# EAGLE schematic battery_buzzer (EAGLE 6.6.0)
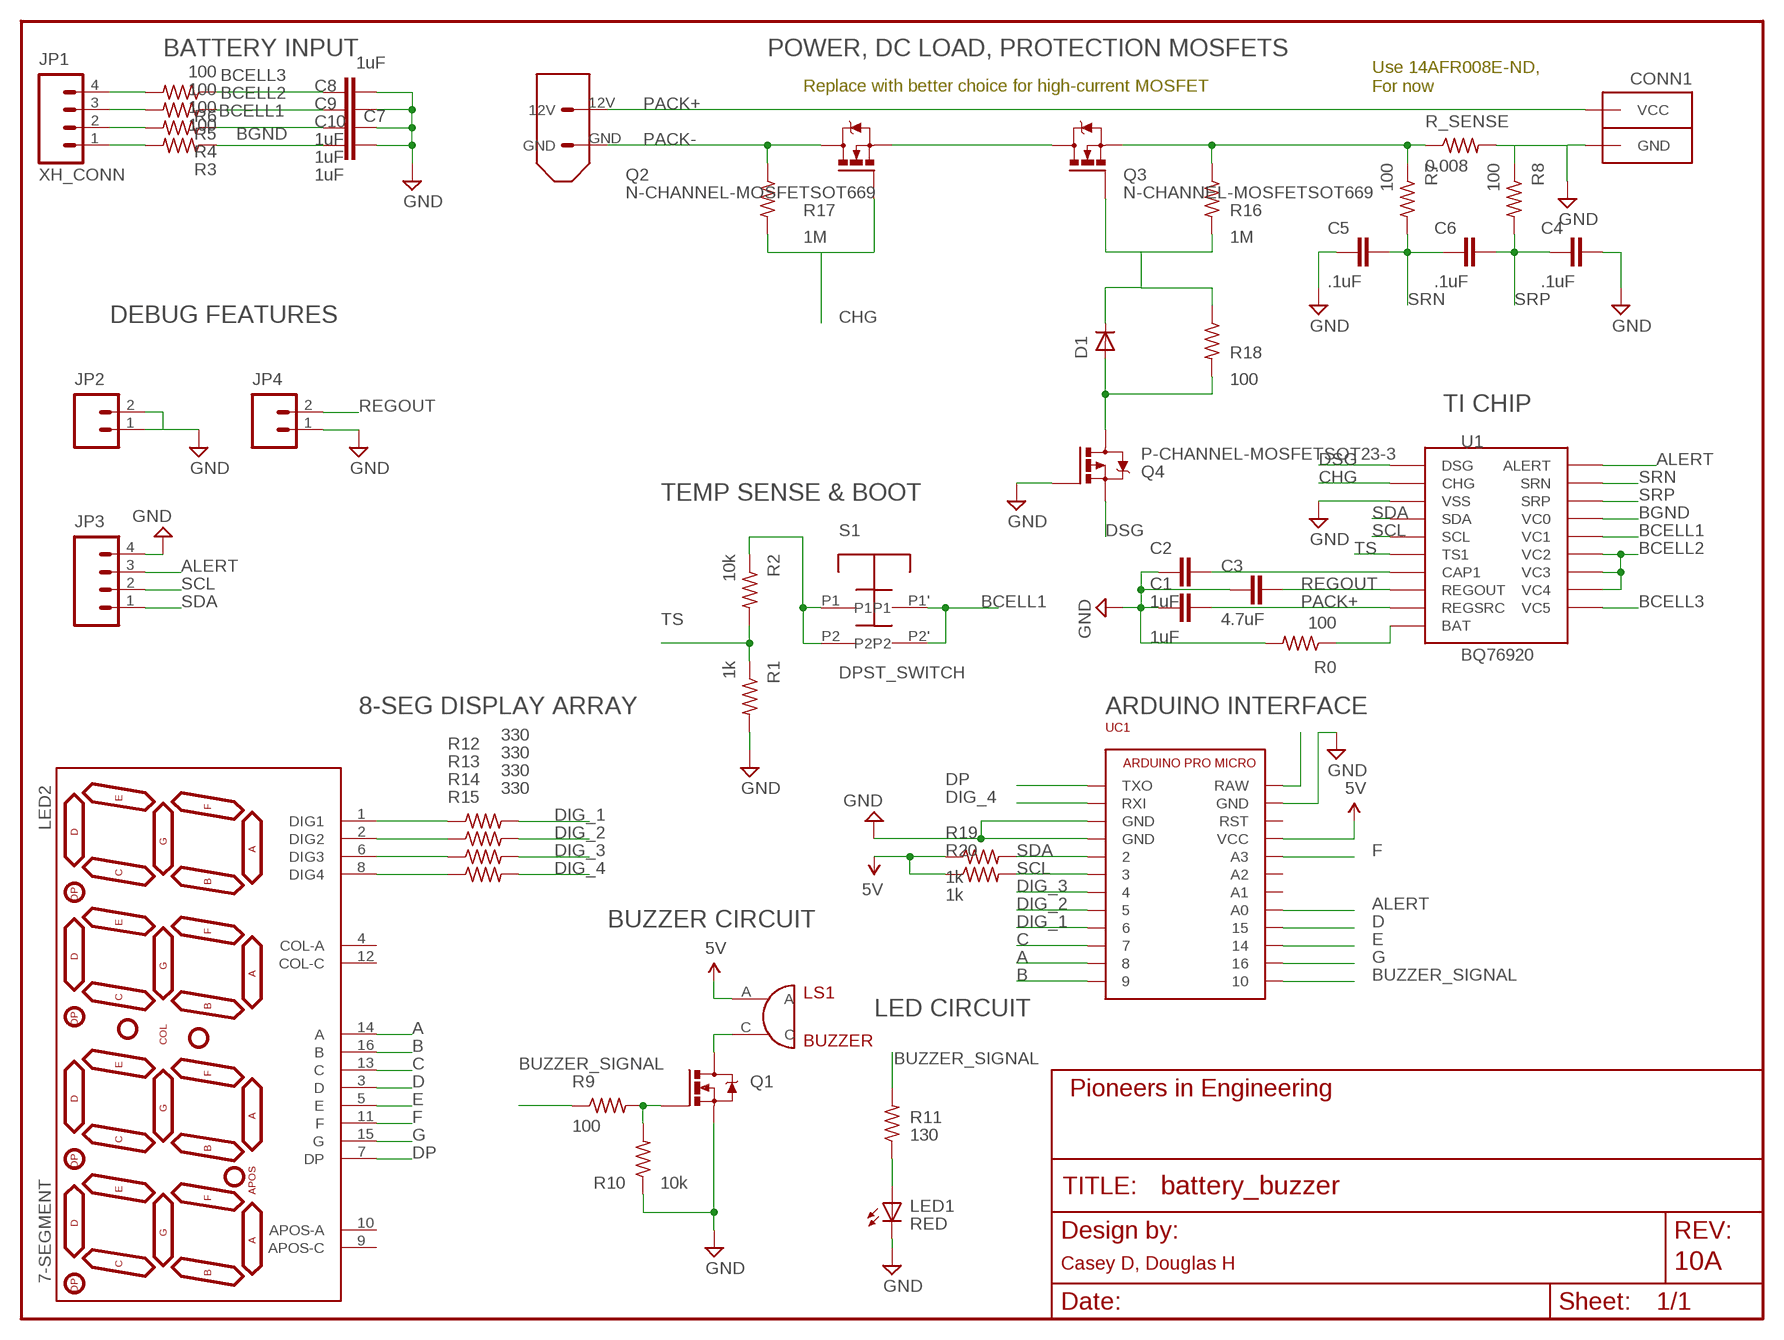
[diagram p0: schematic, sheet 1]
FRAME1 (FRAME-LETTER): AUTHOR: Casey D, Douglas H; REVISION: 10A

## Parts
C1  1uF  CAP0603-CAP  [0603-CAP]
C2  1uF  CAP0603-CAP  [0603-CAP]
C3  4.7uF  CAP0603-CAP  [0603-CAP]
C4  .1uF  CAP0603-CAP  [0603-CAP]
C5  .1uF  CAP0603-CAP  [0603-CAP]
C6  .1uF  CAP0603-CAP  [0603-CAP]
C7  1uF  CAP0603-CAP  [0603-CAP]
C8  1uF  CAP0603-CAP  [0603-CAP]
C9  1uF  CAP0603-CAP  [0603-CAP]
C10  1uF  CAP0603-CAP  [0603-CAP]
CONN1  ANDERSONVERTICAL  [ANDERSON_VERTICAL]
D1  DIODESOD-323  [SOD-323]
JP1  XH_CONN  XH_CONNECTOR_4POS  [XH_CONNECTOR_4POS_2.5MM]
JP2  M02PTH  [1X02]
JP3  M04PTH  [1X04]
JP4  M02PTH  [1X02]
LED1  RED  LED0805  [LED-0805]
LED2  7-SEGMENT  7-SEGMENT-4DIGIT-YOUNGSUN  [7-SEGMENT-4DIGIT-YOUNGSUN]
LS1  BUZZER  [BUZZER_MAGNETIC_5V_12MM_RADIAL]
Q1  IRFML8244  N-CHANNEL-MOSFETSOT23-3  [SOT23-3]
Q2  N-CHANNEL-MOSFETSOT669  [SOT669]
Q3  N-CHANNEL-MOSFETSOT669  [SOT669]
Q4  P-CHANNEL-MOSFETSOT23-3  [SOT23-3]
R0  100  R-US_R0603  [R0603]
R1  1k  R-US_R0603  [R0603]
R2  10k  R-US_R0603  [R0603]
R3  100  R-US_R0603  [R0603]
R4  100  R-US_R0603  [R0603]
R5  100  R-US_R0603  [R0603]
R6  100  R-US_R0603  [R0603]
R7  100  R-US_R0603  [R0603]
R8  100  R-US_R0603  [R0603]
R9  100  R-US_R0603  [R0603]
R10  10k  R-US_R0603  [R0603]
R11  130  R-US_R0603  [R0603]
R12  330  R-US_R0603  [R0603]
R13  330  R-US_R0603  [R0603]
R14  330  R-US_R0603  [R0603]
R15  330  R-US_R0603  [R0603]
R16  1M  R-US_R0603  [R0603]
R17  1M  R-US_R0603  [R0603]
R18  100  R-US_R0603  [R0603]
R19  1k  R-US_R0603  [R0603]
R20  1k  R-US_R0603  [R0603]
R_SENSE  0.008  R-US_V235/17  [V235/17]
S1  DPST_SWITCH  [C&K_SWITCH]
U1  BQ76920  [20-TSSOP]
U$1  XT60CONNECTOR  [XT60CONNECTOR]
UC1  ARDUINO_PRO_MICRO  [ARDUINO_PRO_MICRO]

## Nets
5V: LS1.A R19.1 R20.1 UC1.VCC
A: LED2.14(A) UC1.8
ALERT: JP3.3 U1.P$20(ALERT) UC1.A0
B: LED2.16(B) UC1.9
BCELL1: C9.1 R4.1 S1.P1' S1.P2' U1.P$16(VC1)
BCELL2: C8.1 R5.1 U1.P$13(VC4) U1.P$14(VC3) U1.P$15(VC2)
BCELL3: C7.2 R6.1 U1.P$12(VC5)
BGND: C10.1 R3.1 U1.P$17(VC0)
BUZZER_SIGNAL: R9.1 R11.2 UC1.10
C: LED2.13(C) UC1.7
CHG: Q2.4(G) R17.2 U1.P$2(CHG)
D: LED2.3(D) UC1.15
DIG_1: R12.2 UC1.6
DIG_2: R13.2 UC1.5
DIG_3: R14.2 UC1.4
DIG_4: R15.2 UC1.RXI
DP: LED2.7(DP) UC1.TXO
DSG: Q4.2(S) U1.P$1(DSG)
E: LED2.5(E) UC1.14
F: LED2.11(F) UC1.A3
G: LED2.15(G) UC1.16
GND: C1.1 C2.1 C3.1 C4.2 C5.1 C7.1 C8.2 C9.2 C10.2 CONN1.PIN1(GND) JP2.1 JP2.2 JP3.4 JP4.1 LED1.C Q1.2(S) Q4.1(G) R0.2 R1.2 R8.1 R10.1 R_SENSE.2 U1.P$3(VSS) UC1.GND@0(GND) UC1.GND@1(GND) UC1.GND@2(GND)
N$1: R0.1 U1.P$10(BAT)
N$2: C2.2 U1.P$7(CAP1)
N$3: JP1.1 R3.2
N$4: JP1.2 R4.2
N$5: LS1.C Q1.3(D)
N$6: Q1.1(G) R9.2 R10.2
N$7: LED1.A R11.1
N$8: R2.1 S1.P1 S1.P2
N$9: LED2.1(DIG1) R12.1
N$10: JP1.3 R5.2
N$11: LED2.2(DIG2) R13.1
N$12: JP1.4 R6.2
N$13: LED2.6(DIG3) R14.1
N$14: Q2.1(S) Q2.2(S) Q2.3(S) Q3.MB(D)
N$15: LED2.8(DIG4) R15.1
N$16: Q3.1(S) Q3.2(S) Q3.3(S) R7.1 R16.1 R_SENSE.1
N$17: D1.1(A) Q4.3(D) R18.2
N$18: D1.2(C) Q3.4(G) R16.2 R18.1
PACK+: C1.2 CONN1.PIN2(VCC) U1.P$9(REGSRC) U$1.12V
PACK-: Q2.MB(D) R17.1 U$1.GND
RAW: UC1.RAW
REGOUT: C3.2 JP4.2 U1.P$8(REGOUT)
SCL: JP3.2 R20.2 U1.P$5(SCL) UC1.3
SDA: JP3.1 R19.2 U1.P$4(SDA) UC1.2
SRN: C5.2 C6.1 R7.2 U1.P$19(SRN)
SRP: C4.1 C6.2 R8.2 U1.P$18(SRP)
TS: R1.1 R2.2 U1.P$6(TS1)
Unconnected: LED2.4(COL-A) LED2.9(APOS-C) LED2.10(APOS-A) LED2.12(COL-C) UC1.A1 UC1.A2 UC1.RST

## Notes on the sheet
- BATTERY INPUT | POWER, DC LOAD, PROTECTION MOSFETS
- Replace with better choice for high-current MOSFET
- Use 14AFR008E-ND,
  For now
- DEBUG FEATURES
- TI CHIP
- TEMP SENSE & BOOT
- 8-SEG DISPLAY ARRAY | ARDUINO INTERFACE
- BUZZER CIRCUIT
- LED CIRCUIT

## Library data of the parts
C1-C10 = pie:CAP: Capacitor Standard 0603 ceramic capacitor, and 0.1" leaded capacitor.; PIE-INT-REF-NUM: CAPACITOR-GENERIC
CONN1 = pie:ANDERSON: 2-pin 25A Anderson Connector http://www.alliedelec.com/images/products/datasheets/bm/ANDERSON_POWER_PRODUCTS/70162018.pdf; PIE-INT-REF-NUM: Anderson
D1 = pie:DIODE: Diode These are standard reverse protection diodes and small signal diodes. SMA package can handle up to about 1A. SOD-323 can handle about 200mA. What the SOD-323 package when ordering, there are some mfgs out there that are 5-pin packages.; PIE-INT-REF-NUM: DIODE
JP1 = pie:XH_CONNECTOR_4POS: 4-pin XH connector (through-hole type shrouded header); PIE-INT-REF-NUM: XH-4POS; PIE_DIGIKEY-PN: 455-2249-ND
JP2 JP4 = pie:M02: 2-pin 0.1-inch header and MTA connector; PIE-INT-REF-NUM: BULK-STOCK
JP3 = pie:M04: 4-pin 0.1-inch header and MTA connector; PIE-INT-REF-NUM: BULK-STOCK
LED1 = pie:LED: LEDs Standard schematic elements and footprints for 5mm, 3mm, 1206, and 0603 sized LEDs. 5mm - Spark Fun Electronics SKU : COM-00529 (and others); PIE-INT-REF-NUM: LED
LED2 = pie:7-SEGMENT-4DIGIT-YOUNGSUN: This is a part for the 4-Digit 7-segment LEDs from Young Sun. Different from the Digikey LEDs, all 16 pins are used. The LONGPADS Variant is used for a test jig, but you may like it because there is more pad to solder to. If you are concerned about routing space, the standard works just fine though.
LS1 = pie:BUZZER: Buzzer; PIE-INT-REF-NUM: BUZZER; PIE_DIGIKEY-PN: 102-1269-ND
Q1 = pie:N-CHANNEL-MOSFET: N-channel TrenchMOS (TM) logic level FET Source: SOT23-3: http://www.nxp.com/documents/data_sheet/BSS123.pdf SOT669: http://www.nxp.com/documents/data_sheet/PH7030L.pdf
Q2 Q3 = pie:N-CHANNEL-MOSFET: N-channel TrenchMOS (TM) logic level FET Source: SOT23-3: http://www.nxp.com/documents/data_sheet/BSS123.pdf SOT669: http://www.nxp.com/documents/data_sheet/PH7030L.pdf; PIE-DIGIKEY-PN-PRI: 568-6738-1-ND; PIE-INT-REF-NUM: NMOS
Q4 = pie:P-CHANNEL-MOSFET: P-Channel PowerTrench® MOSFET Source: FDD4141.pdf; PIE-DIGIKEY-PN-PRI: IRLML6402PBFCT-ND; PIE-INT-REF-NUM: PMOS
R0 R1-R20 R_SENSE = pie:R-US_: RESISTOR, American symbol; PIE-INT-REF-NUM: RESISTOR-GENERIC
S1 = pie:DPST_SWITCH: Double Throw, single pole normally open pushbutton switch. 401-1133-ND
U1 = pie:BQ76920: BQ76920, a TSSOP Battery monotoring chip by TI
U$1 = pie:XT60CONNECTOR: 12V XT60 power connector; PARTNUMBER: PRT-10474
UC1 = pie:ARDUINO_PRO_MICRO: Arduino Pro Micro Electrical System Year 9's Smart Sensor Core Pin Outs <https://cdn.sparkfun.com/assets/9/c/3/c/4/523a1765757b7f5c6e8b4567.png> Buy Here <http://www.aliexpress.com/item/Mini-Leonardo-Pro-Micro-ATmega32U4-5V-16MHz-Module-For-Arduino-Best-Quality/32284746884.html?ws_ab_test=searchweb201556_8,searchweb201602_2_10057_10056_10065_10055_10054_10067_10069_10059_10058_10017_10070_10060_10061_10052_10062_10053_10050_10051,searchweb201603_1&btsid=45993952-29ca-4de4-a0fb-c7fb72b8e1a5>